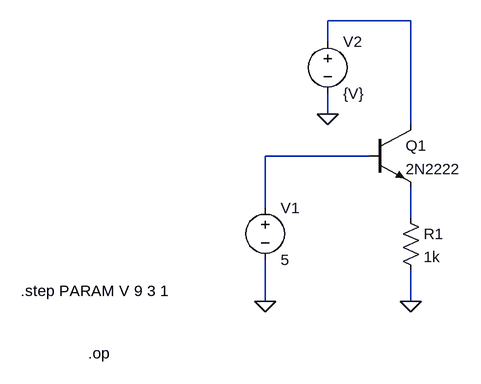
[diagram p0: schematic Draft2.asc]
Draft2.asc, the LTspice schematic file:
Version 4
SHEET 1 880 680
WIRE 336 -112 208 -112
WIRE 208 -80 208 -112
WIRE 208 32 208 0
WIRE 336 48 336 -112
WIRE 272 96 112 96
WIRE 112 176 112 96
WIRE 336 192 336 144
WIRE 112 320 112 256
WIRE 336 320 336 272
FLAG 112 320 0
FLAG 336 320 0
FLAG 208 32 0
SYMBOL voltage 112 160 R0
SYMATTR InstName V1
SYMATTR Value 5
SYMBOL npn 272 48 R0
SYMATTR InstName Q1
SYMATTR Value 2N2222
SYMBOL Res 320 176 R0
SYMATTR InstName R1
SYMATTR Value 1k
SYMBOL Voltage 208 -96 R0
SYMATTR InstName V2
SYMATTR Value {V}
TEXT -160 400 Left 2 !.op
TEXT -264 304 Left 2 !.step PARAM V 9 3 1

The netlist it stands for:
* Draft2.asc
V1 N002 0 5
Q1 N001 N002 N003 0 2N2222
R1 N003 0 1k
V2 N001 0 {V}
.model NPN NPN
.model PNP PNP
.lib standard.bjt
.op
.step PARAM V 9 3 1
.backanno
.end